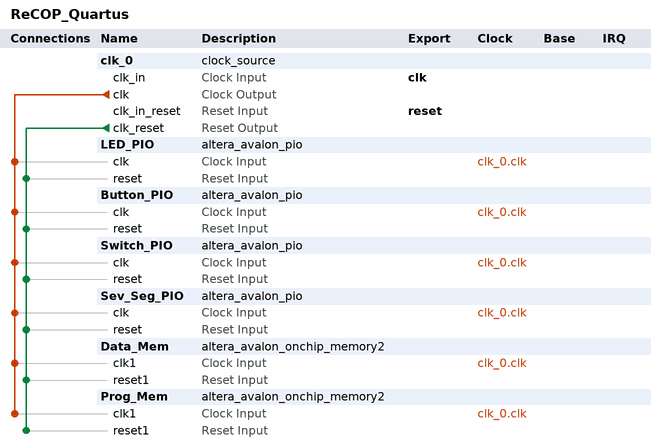
[diagram p0: system contents]
# Platform Designer (Qsys) system ReCOP_Quartus, Cyclone V 5CSEMA5F31C6
# Parameters at their usual value, and those the tool derives, are not listed.
package require -exact qsys 18.1
create_system ReCOP_Quartus
set_project_property DEVICE_FAMILY {Cyclone V}
set_project_property DEVICE 5CSEMA5F31C6

add_instance clk_0 clock_source 18.1
set_instance_parameter_value clk_0 clockFrequency 50000000

add_instance LED_PIO altera_avalon_pio 18.1
set_instance_parameter_value LED_PIO direction Output
set_instance_parameter_value LED_PIO width 8

add_instance Button_PIO altera_avalon_pio 18.1
set_instance_parameter_value Button_PIO captureEdge true
set_instance_parameter_value Button_PIO direction Input
set_instance_parameter_value Button_PIO generateIRQ true
set_instance_parameter_value Button_PIO irqType EDGE
set_instance_parameter_value Button_PIO width 4

add_instance Switch_PIO altera_avalon_pio 18.1
set_instance_parameter_value Switch_PIO direction Input
set_instance_parameter_value Switch_PIO width 8

add_instance Sev_Seg_PIO altera_avalon_pio 18.1
set_instance_parameter_value Sev_Seg_PIO direction Output
set_instance_parameter_value Sev_Seg_PIO width 28

add_instance Data_Mem altera_avalon_onchip_memory2 18.1
set_instance_parameter_value Data_Mem dataWidth 16
set_instance_parameter_value Data_Mem dualPort false
set_instance_parameter_value Data_Mem initMemContent true
set_instance_parameter_value Data_Mem initializationFileName data_memory.hex
set_instance_parameter_value Data_Mem memorySize 4096
set_instance_parameter_value Data_Mem useNonDefaultInitFile true

add_instance Prog_Mem altera_avalon_onchip_memory2 18.1
set_instance_parameter_value Prog_Mem dataWidth 16
set_instance_parameter_value Prog_Mem dualPort false
set_instance_parameter_value Prog_Mem initMemContent true
set_instance_parameter_value Prog_Mem initializationFileName program-memory.hex
set_instance_parameter_value Prog_Mem memorySize 4096
set_instance_parameter_value Prog_Mem useNonDefaultInitFile true

# connections
add_connection clk_0.clk Button_PIO.clk clock
add_connection clk_0.clk Data_Mem.clk1 clock
add_connection clk_0.clk LED_PIO.clk clock
add_connection clk_0.clk Prog_Mem.clk1 clock
add_connection clk_0.clk Sev_Seg_PIO.clk clock
add_connection clk_0.clk Switch_PIO.clk clock
add_connection clk_0.clk_reset Button_PIO.reset reset
add_connection clk_0.clk_reset Data_Mem.reset1 reset
add_connection clk_0.clk_reset LED_PIO.reset reset
add_connection clk_0.clk_reset Prog_Mem.reset1 reset
add_connection clk_0.clk_reset Sev_Seg_PIO.reset reset
add_connection clk_0.clk_reset Switch_PIO.reset reset

# exported interfaces
add_interface clk clock sink
set_interface_property clk EXPORT_OF clk_0.clk_in
add_interface reset reset sink
set_interface_property reset EXPORT_OF clk_0.clk_in_reset

set_interconnect_requirement {$system} qsys_mm.clockCrossingAdapter HANDSHAKE
set_interconnect_requirement {$system} qsys_mm.enableEccProtection FALSE
set_interconnect_requirement {$system} qsys_mm.insertDefaultSlave FALSE
set_interconnect_requirement {$system} qsys_mm.maxAdditionalLatency 1

save_system ReCOP_Quartus.qsys
